# EAGLE schematic watch_game_2022_revB (EAGLE 8.7.1)
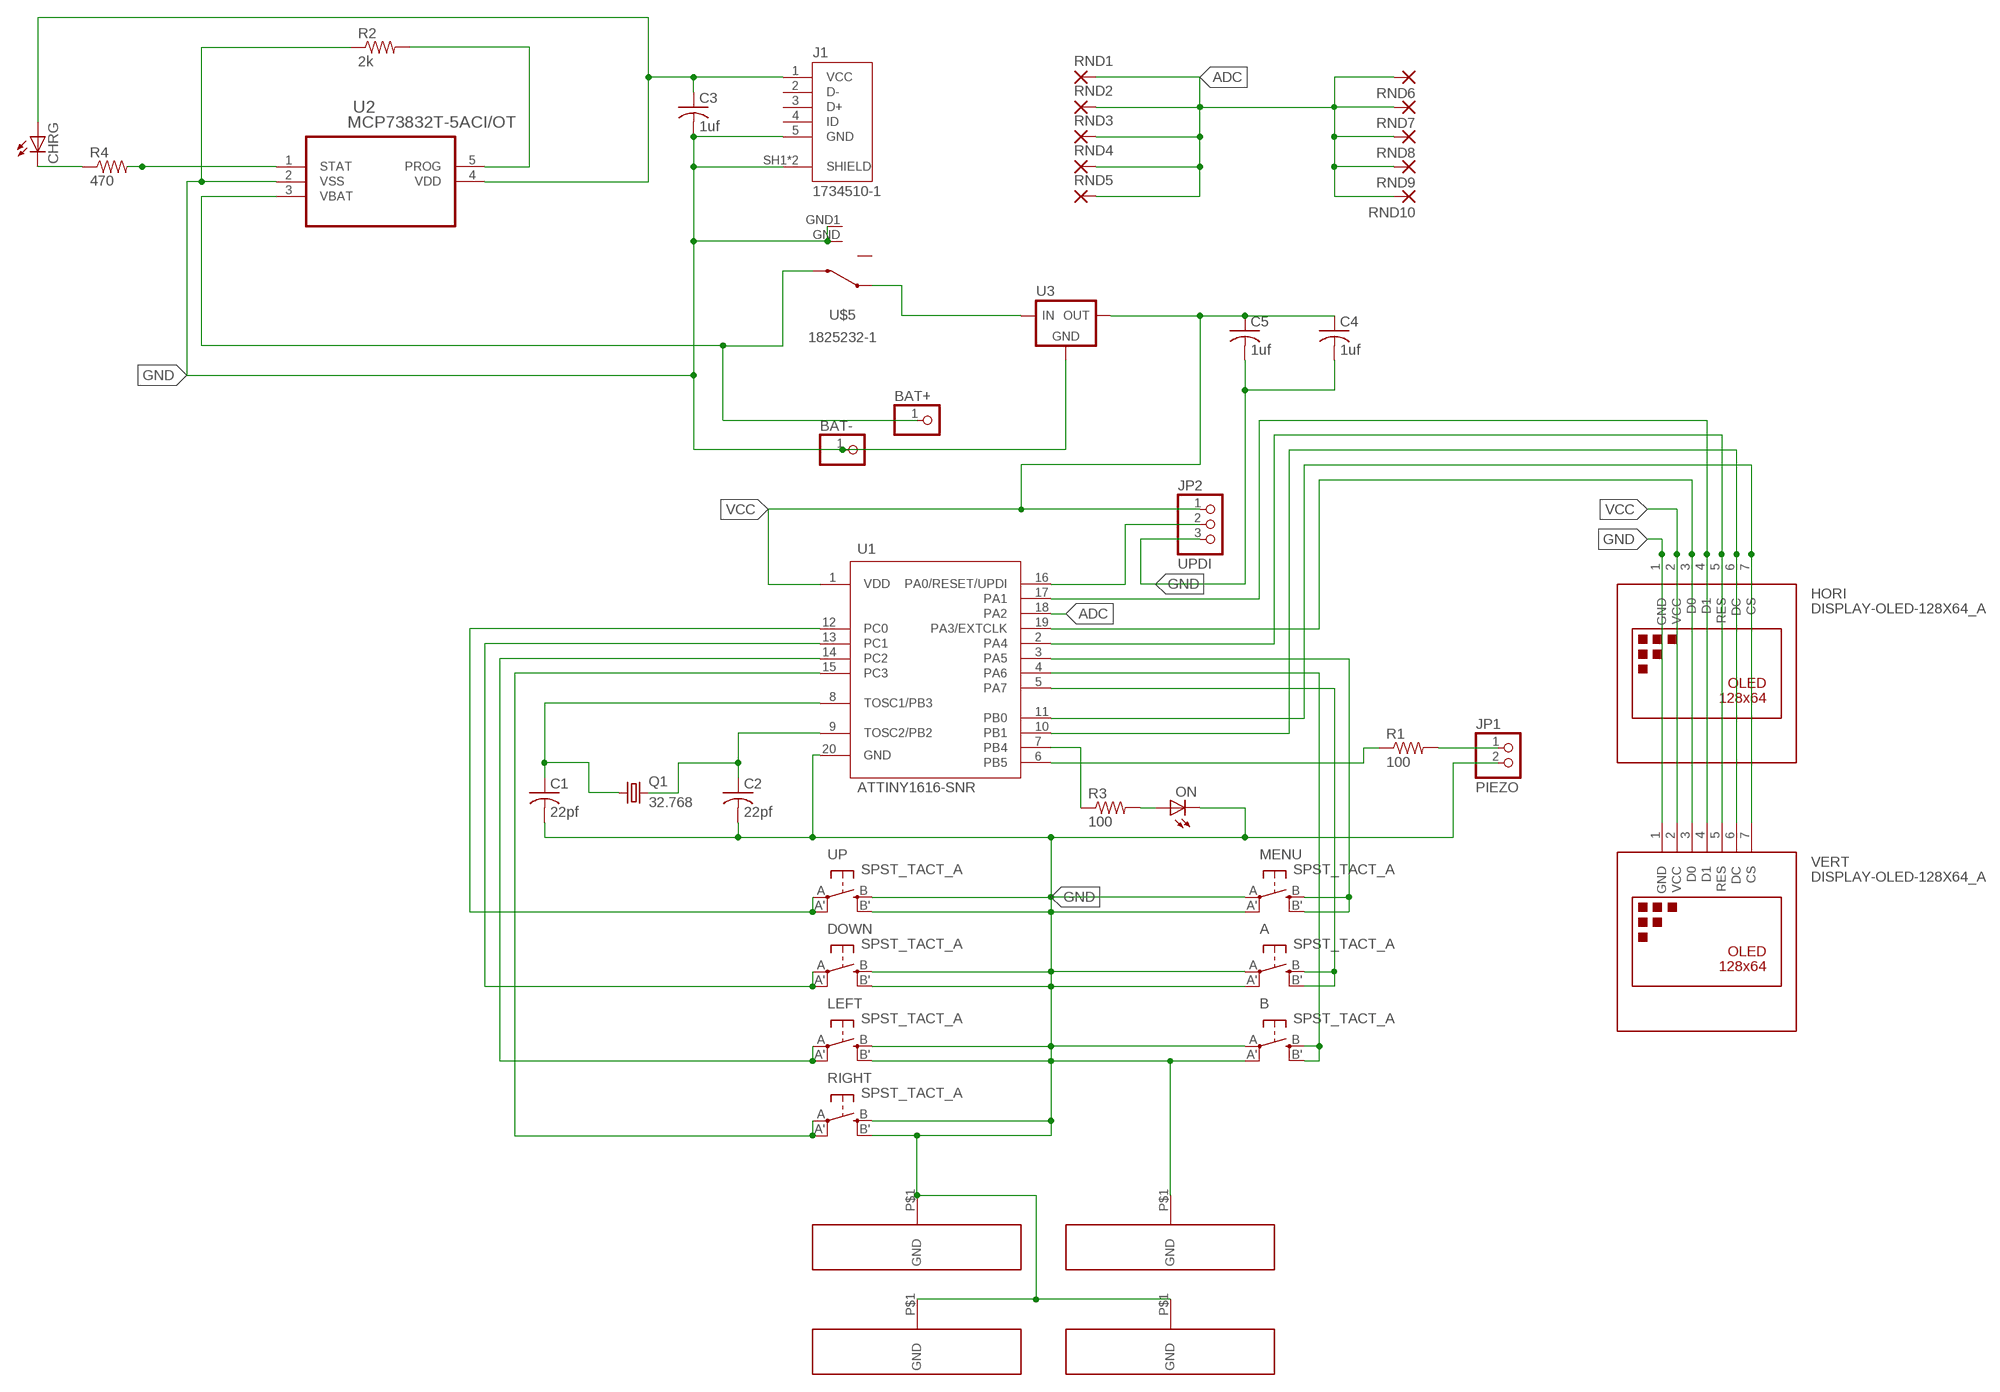
[diagram p0: schematic, sheet 1]

## Parts
A  SPST_TACT_A  [EVQ-Q2_A]
B  SPST_TACT_A  [EVQ-Q2_A]
BAT+  PINHD-1X1  [1X01]
BAT-  PINHD-1X1  [1X01]
C1  22pf  C-USC0805  [C0805]
C2  22pf  C-USC0805  [C0805]
C3  1uf  C-USC0805  [C0805]
C4  1uf  C-USC0805  [C0805]
C5  1uf  C-USC0805  [C0805]
CHRG  LED3MM  [LED3MM]
DOWN  SPST_TACT_A  [EVQ-Q2_A]
HORI  DISPLAY-OLED-128X64_A  [DISPLAY-OLED-128X64_A]
J1  1734510-1  [TE_1734510-1]
JP1  PIEZO  PINHD-1X2  [1X02]
JP2  UPDI  PINHD-1X3  [1X03]
LEFT  SPST_TACT_A  [EVQ-Q2_A]
MENU  SPST_TACT_A  [EVQ-Q2_A]
ON  LED5MM  [LED5MM]
Q1  32.768  CRYSTALTC26H  [TC26H]
R1  100  R-US_M0805  [M0805]
R2  2k  R-US_M0805  [M0805]
R3  100  R-US_M0805  [M0805]
R4  470  R-US_M0805  [M0805]
RIGHT  SPST_TACT_A  [EVQ-Q2_A]
RND1  SMD5  [SMD2,54-5,08]
RND2  SMD5  [SMD2,54-5,08]
RND3  SMD5  [SMD2,54-5,08]
RND4  SMD5  [SMD2,54-5,08]
RND5  SMD5  [SMD2,54-5,08]
RND6  SMD5  [SMD2,54-5,08]
RND7  SMD5  [SMD2,54-5,08]
RND8  SMD5  [SMD2,54-5,08]
RND9  SMD5  [SMD2,54-5,08]
RND10  SMD5  [SMD2,54-5,08]
U1  ATTINY1616-SNR  [SOIC127P1032X265-20N]
U2  MCP73832T-5ACI/OT  [SOT95P300X145-5N]
U3  NCP5501DT33RKG  [DPAK]
U$5  1825232-1  [1825232-1]
U$6  GND_STRIP_600MIL  [GND_PADS_2]
U$7  GND_STRIP_600MIL  [GND_PADS_2]
U$8  GND_STRIP_600MIL  [GND_PADS_2]
U$9  GND_STRIP_600MIL  [GND_PADS_2]
UP  SPST_TACT_A  [EVQ-Q2_A]
VERT  DISPLAY-OLED-128X64_A  [DISPLAY-OLED-128X64_A]

## Nets
ADC: RND1.1(P) RND2.1(P) RND3.1(P) RND4.1(P) RND5.1(P) RND6.1(P) RND7.1(P) RND8.1(P) RND9.1(P) RND10.1(P) U1.18(PA2)
GND: A.A'(P1) A.A(P) B.A'(P1) B.A(P) BAT-.1 C1.2 C2.2 C3.2 C4.2 C5.2 DOWN.B'(S1) DOWN.B(S) HORI.1(GND) J1.5(GND) J1.SH1(SHIELD) J1.SH2(SHIELD) JP1.2 JP2.3 LEFT.B'(S1) LEFT.B(S) MENU.A'(P1) MENU.A(P) ON.K(C) R2.1 RIGHT.B'(S1) RIGHT.B(S) U1.20(GND) U2.2(VSS) U3.4(GND) U$5.GND U$5.GND1 U$6.P$1(GND) U$7.P$1(GND) U$8.P$1(GND) U$9.P$1(GND) UP.B'(S1) UP.B(S) VERT.1(GND)
N$1: U1.12(PC0) UP.A'(P1) UP.A(P)
N$2: DOWN.A'(P1) DOWN.A(P) U1.13(PC1)
N$3: LEFT.A'(P1) LEFT.A(P) U1.14(PC2)
N$4: RIGHT.A'(P1) RIGHT.A(P) U1.15(PC3)
N$5: B.B'(S1) B.B(S) U1.4(PA6)
N$6: HORI.3(D0) U1.19(PA3/EXTCLK) VERT.3(D0)
N$7: R3.1 U1.7(PB4)
N$8: JP1.1 R1.2
N$9: C3.1 CHRG.A J1.1(VCC) U2.4(VDD)
N$10: U3.1(VIN) U$5.3
N$11: R4.2 U2.1(STAT)
N$12: BAT+.1 U2.3(VBAT) U$5.2
N$13: JP2.2 U1.16(PA0/RESET/UPDI)
N$14: HORI.4(D1) U1.17(PA1) VERT.4(D1)
N$16: HORI.5(RES) U1.2(PA4) VERT.5(RES)
N$17: MENU.B'(S1) MENU.B(S) U1.3(PA5)
N$18: ON.A R3.2
N$19: A.B'(S1) A.B(S) U1.5(PA7)
N$20: HORI.7(CS) U1.11(PB0) VERT.7(CS)
N$21: HORI.6(DC) U1.10(PB1) VERT.6(DC)
N$23: R1.1 U1.6(PB5)
N$24: C1.1 Q1.1 U1.8(TOSC1/PB3)
N$25: C2.1 Q1.2 U1.9(TOSC2/PB2)
N$26: R2.2 U2.5(PROG)
N$27: CHRG.K(C) R4.1
VCC: C4.1 C5.1 HORI.2(VCC) JP2.1 U1.1(VDD) U3.3(VOUT) VERT.2(VCC)
Unconnected: J1.2(D-) J1.3(D+) J1.4(ID) U$5.1

## Library data of the parts
A B DOWN LEFT MENU RIGHT UP = adafruit:SPST_TACT_A: SMT 6mm switch, EVQQ2 series http://www.ladyada.net/library/eagle
BAT+ BAT- = adafruit:PINHD-1X1: Pin header 1x1 for 0.1" spacing With round pins
C1 C2 = adafruit:C-US: CAPACITOR, American symbol
C3-C5 = rcl:C-US: CAPACITOR, American symbol; SPICEPREFIX: C
CHRG = adafruit:LED: LED
HORI VERT = diy-modules:DISPLAY-OLED-128X64_A: 128x64 Dot Matrix OLED Module based on SSD1306 chip Variant with SPI interface More details available here: http://www.instructables.com/id/How-to-use-OLED-display-arduino-module/ SSD1306 datasheet: https://cdn-shop.adafruit.com/datasheets/SSD1306.pdf Click here to find device on ebay.com <http://www.ebay.com/sch/oled+display+128x64> Note: There are two variants: I2C and SPI. Search for the proper version.
J1 = USB 1734510-1:1734510-1: Conn Mini USB Type B RCP 5 POS 1.6mm Solder RA Thru-Hole 5 Terminal 1 Port Tray Check prices <https://pricing.snapeda.com/parts/1734510-1/TE%20Connectivity/view-part?ref=eda>; AVAILABILITY: In Stock; COMMENT: 1734510-1; DESCRIPTION: Conn Mini USB Type B RCP 5 POS 1.6mm Solder RA Thru-Hole 5 Terminal 1 Port Tray; MF: TE Connectivity; MP: 1734510-1; PACKAGE: None; PRICE: None; PURCHASE-URL: https://pricing.snapeda.com/search/part/1734510-1/?ref=eda
JP1 = pinhead:PINHD-1X2: PIN HEADER
JP2 = pinhead:PINHD-1X3: PIN HEADER
ON = led:LED: LED
Q1 = adafruit:CRYSTAL: CRYSTAL; OC_FARNELL: unknown; OC_NEWARK: unknown
R1-R4 = resistor:R-US_: RESISTOR, American symbol
RND1-RND10 = wirepad:SMD5: SMD PAD
U1 = ATTINY1616-SNR:ATTINY1616-SNR: ATTiny1616 is a 20 pin Microcontroller with: - 5 selectable Voltage reference - 8 bit Dac - Multiplexable IOs(SPI, UART, I2C) And much more Datasheet <http://ww1.microchip.com/downloads/en/DeviceDoc/ATtiny1616-3216-DataSheet-DS40001997C.pdf> Check prices <https://pricing.snapeda.com/parts/ATTINY1616-SNR/Microchip/view-part?ref=eda>; AVAILABILITY: In Stock; DESCRIPTION: AVR tinyAVR™ 1, Functional Safety (FuSa) Microcontroller IC 8-Bit 20MHz 16KB (16K x 8) FLASH 20-SOIC; MF: Microchip; MP: ATTINY1616-SNR; PACKAGE: SOIC-20 Microchip; PRICE: None; PURCHASE-URL: https://pricing.snapeda.com/search/part/ATTINY1616-SNR/?ref=eda
U2 = MCP73832T-5ACI_OT:MCP73832T-5ACI/OT: IC, BATT CHARGER, Li-Ion Li-Polymer, 500 mA Check availability <https://pricing.snapeda.com/parts/MCP73832T-5ACI/OT/Microchip/view-part?ref=eda>; AVAILABILITY: In Stock; DESCRIPTION: Charger IC Lithium Ion/Polymer SOT-23-5; MF: Microchip; MP: MCP73832T-5ACI/OT; PACKAGE: SOT-23 Microchip; PRICE: None; PURCHASE-URL: https://pricing.snapeda.com/search/part/MCP73832T-5ACI/OT/?ref=eda
U3 = bt_regulator:NCP5501DT33RKG: LDO Voltage Regulators 500 mA 3.3V LDO Very low-dropout voltage (0.45 V) Very low quiescent current (typ. 50 µA in OFF mode, 500 µA in ON mode) Output current up to 500 mA Logic-controlled electronic shutdown Output voltages of 1.5; 1.8; 2.5; 3.3; 4.7; 5; 6; 8; 8.5; 9; 12 V Automotive grade product: 1.8 V, 2.5 V, 3.3 V 5.0 V, 8.0 V, 8.5 V VOUT in DPAK and PPAK packages Internal current and thermal limit Only 2.2 µF for stability Available in ±1% (AB), ± 1.5% (AC) or ± 2% (C) selection at 25 °C Supply voltage rejection: 80 db (typ.) Temperature range: from -40 to 125 °C The LFxxAB/LFxxC are very low drop regulators available in PENTAWATT, TO-220, TO-220FP, DPAK and PPAK package and in a wide range of output voltages. The very low drop voltage (0.45 V) and the very low quiescent current make them particularly suitable for low noise, low power applications and specially in battery powered systems Datasheet.pdf <http://www.st.com/web/en/resource/technical/document/datasheet/CD00000546.pdf>
U$5 = switch 1825232-1:1825232-1: Check prices <https://pricing.snapeda.com/parts/1825232-1/TE%20Connectivity/view-part?ref=eda>; AVAILABILITY: In Stock; COMMENT: 1825232-1; DESCRIPTION: Switch Slide ON None ON SPDT Side Slide 0.2A 30VDC 10000Cycle PC Pins Bracket Mount/Through Hole; EU_ROHS_COMPLIANCE: Compliant; MF: TE Connectivity; MP: 1825232-1; PACKAGE: None; PRICE: None; PURCHASE-URL: https://pricing.snapeda.com/search/part/1825232-1/?ref=eda
U$6-U$9 = Atari Vagabond:GND_STRIP_600MIL